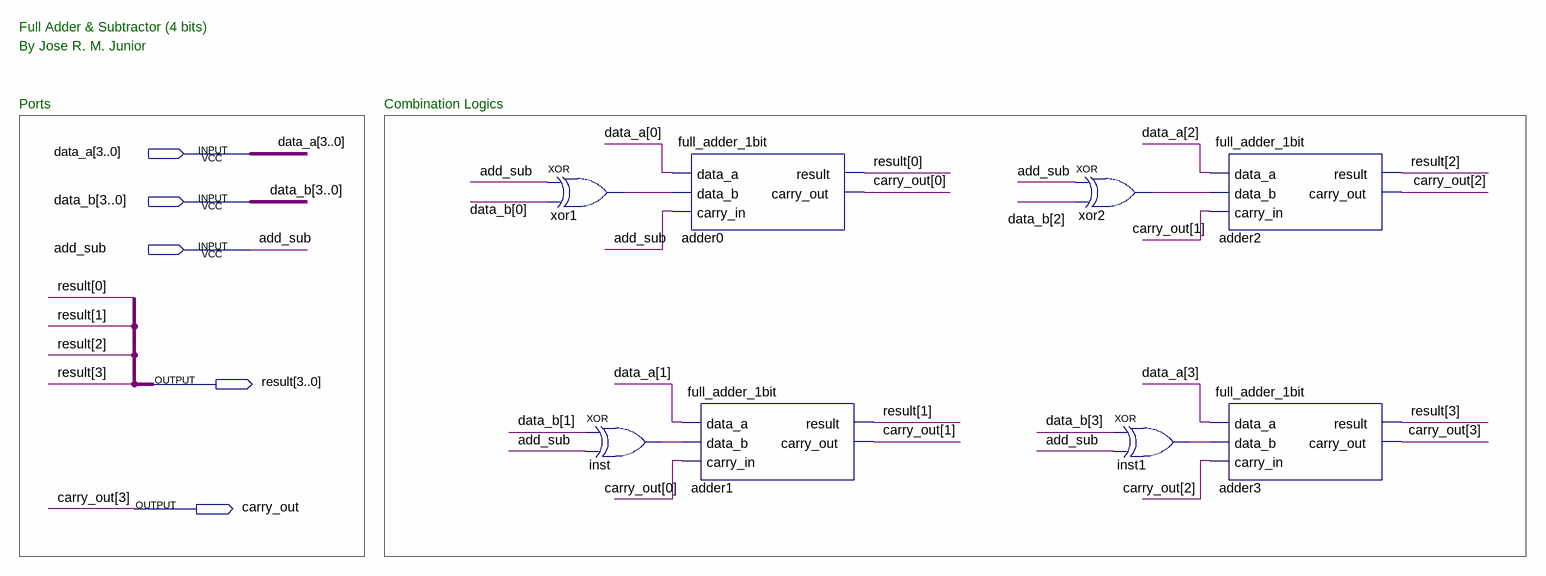
[diagram p0: schematic sheet]
// Quartus schematic add_sub_4bits.bdf as structural Verilog: 8 symbols, 5 pins
module add_sub_4bits (
  input  [3:0] data_a,
  input  [3:0] data_b,
  input  add_sub,
  output [3:0] result,
  output carry_out
);

  wire inst1_out, inst_out, xor1_out, xor2_out;
  wire [2:0] carry_out_bus;

  xor xor1 (xor1_out, add_sub, data_b[0]);
  xor inst (inst_out, data_b[1], add_sub);
  full_adder_1bit adder0 (
    .data_a(data_a[0]), .data_b(xor1_out), .carry_in(add_sub), .result(result[0]),
    .carry_out(carry_out_bus[0]));
  full_adder_1bit adder1 (
    .data_a(data_a[1]), .data_b(inst_out), .carry_in(carry_out_bus[0]), .result(result[1]),
    .carry_out(carry_out_bus[1]));
  xor xor2 (xor2_out, add_sub, data_b[2]);
  xor inst1 (inst1_out, data_b[3], add_sub);
  full_adder_1bit adder2 (
    .data_a(data_a[2]), .data_b(xor2_out), .carry_in(carry_out_bus[1]), .result(result[2]),
    .carry_out(carry_out_bus[2]));
  full_adder_1bit adder3 (
    .data_a(data_a[3]), .data_b(inst1_out), .carry_in(carry_out_bus[2]), .result(result[3]),
    .carry_out(carry_out));

  // Other names for the same wires on the sheet: carry_out[3] = carry_out

  // Notes on the sheet:
  //   Full Adder & Subtractor (4 bits)
  //   By Jose R. M. Junior
  //   Ports
  //   Combination Logics
endmodule
